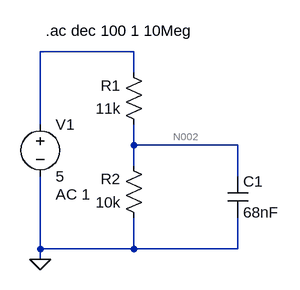
[diagram p0: schematic RCFilterWithRealValues.asc]
RCFilterWithRealValues.asc, the LTspice schematic file:
Version 4.1
SHEET 1 880 680
WIRE 192 0 48 0
WIRE 192 32 192 0
WIRE 48 112 48 0
WIRE 192 144 192 112
WIRE 352 144 192 144
WIRE 192 176 192 144
WIRE 352 192 352 144
WIRE 48 304 48 192
WIRE 192 304 192 256
WIRE 192 304 48 304
WIRE 352 304 352 256
WIRE 352 304 192 304
WIRE 48 320 48 304
FLAG 48 320 0
SYMBOL voltage 48 96 R0
WINDOW 123 24 124 Left 2
WINDOW 39 0 0 Left 0
SYMATTR InstName V1
SYMATTR Value 5
SYMATTR Value2 AC 1
SYMBOL res 208 128 R180
WINDOW 0 36 76 Left 2
WINDOW 3 36 40 Left 2
SYMATTR InstName R1
SYMATTR Value 11k
SYMBOL res 208 272 R180
WINDOW 0 36 76 Left 2
WINDOW 3 36 40 Left 2
SYMATTR InstName R2
SYMATTR Value 10k
SYMBOL cap 336 192 R0
SYMATTR InstName C1
SYMATTR Value 68nF
TEXT 56 -32 Left 2 !.ac dec 100 1 10Meg

The netlist it stands for:
* RCFilterWithRealValues.asc
V1 N001 0 5 AC 1
R1 N002 N001 11k
R2 0 N002 10k
C1 N002 0 68nF
.ac dec 100 1 10Meg
.backanno
.end

* Results of the author's LTspice run, read from the files saved beside the schematic
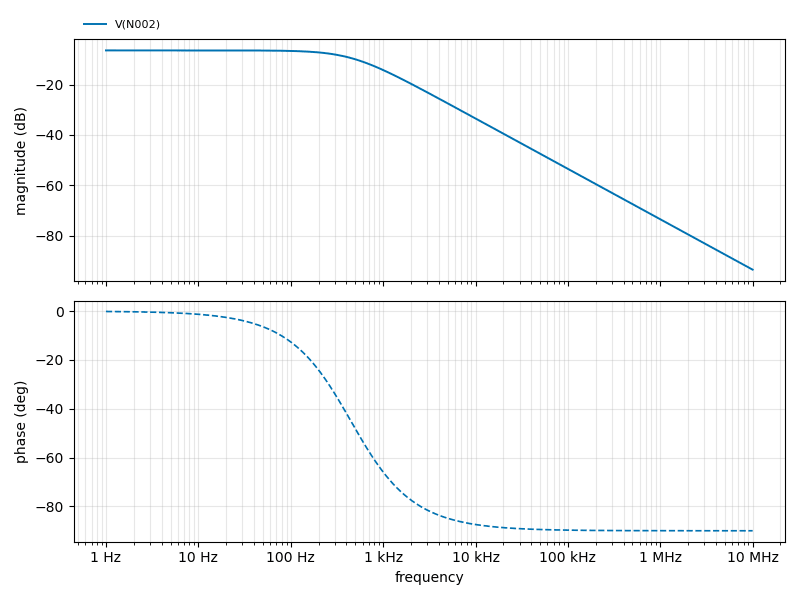
[diagram p1: AC Analysis of RCFilterWithRealValues.asc, plotted from the saved traces]
* AC Analysis, 1 run:
*   V(N002): -6.44 dB at 1 Hz, -93.44 dB at 10 MHz, peak -6.44 dB at 1 Hz, 3 dB below the peak at 446.8 Hz